# EasyEDA schematic Sheet_1.json
TITLE: 8 Bit ALU - Q XOR M; REV: 1.0; Date: 2021-12-29; Sheet: 1/3; Drawn By: Koehler, Paul; Company: komed3
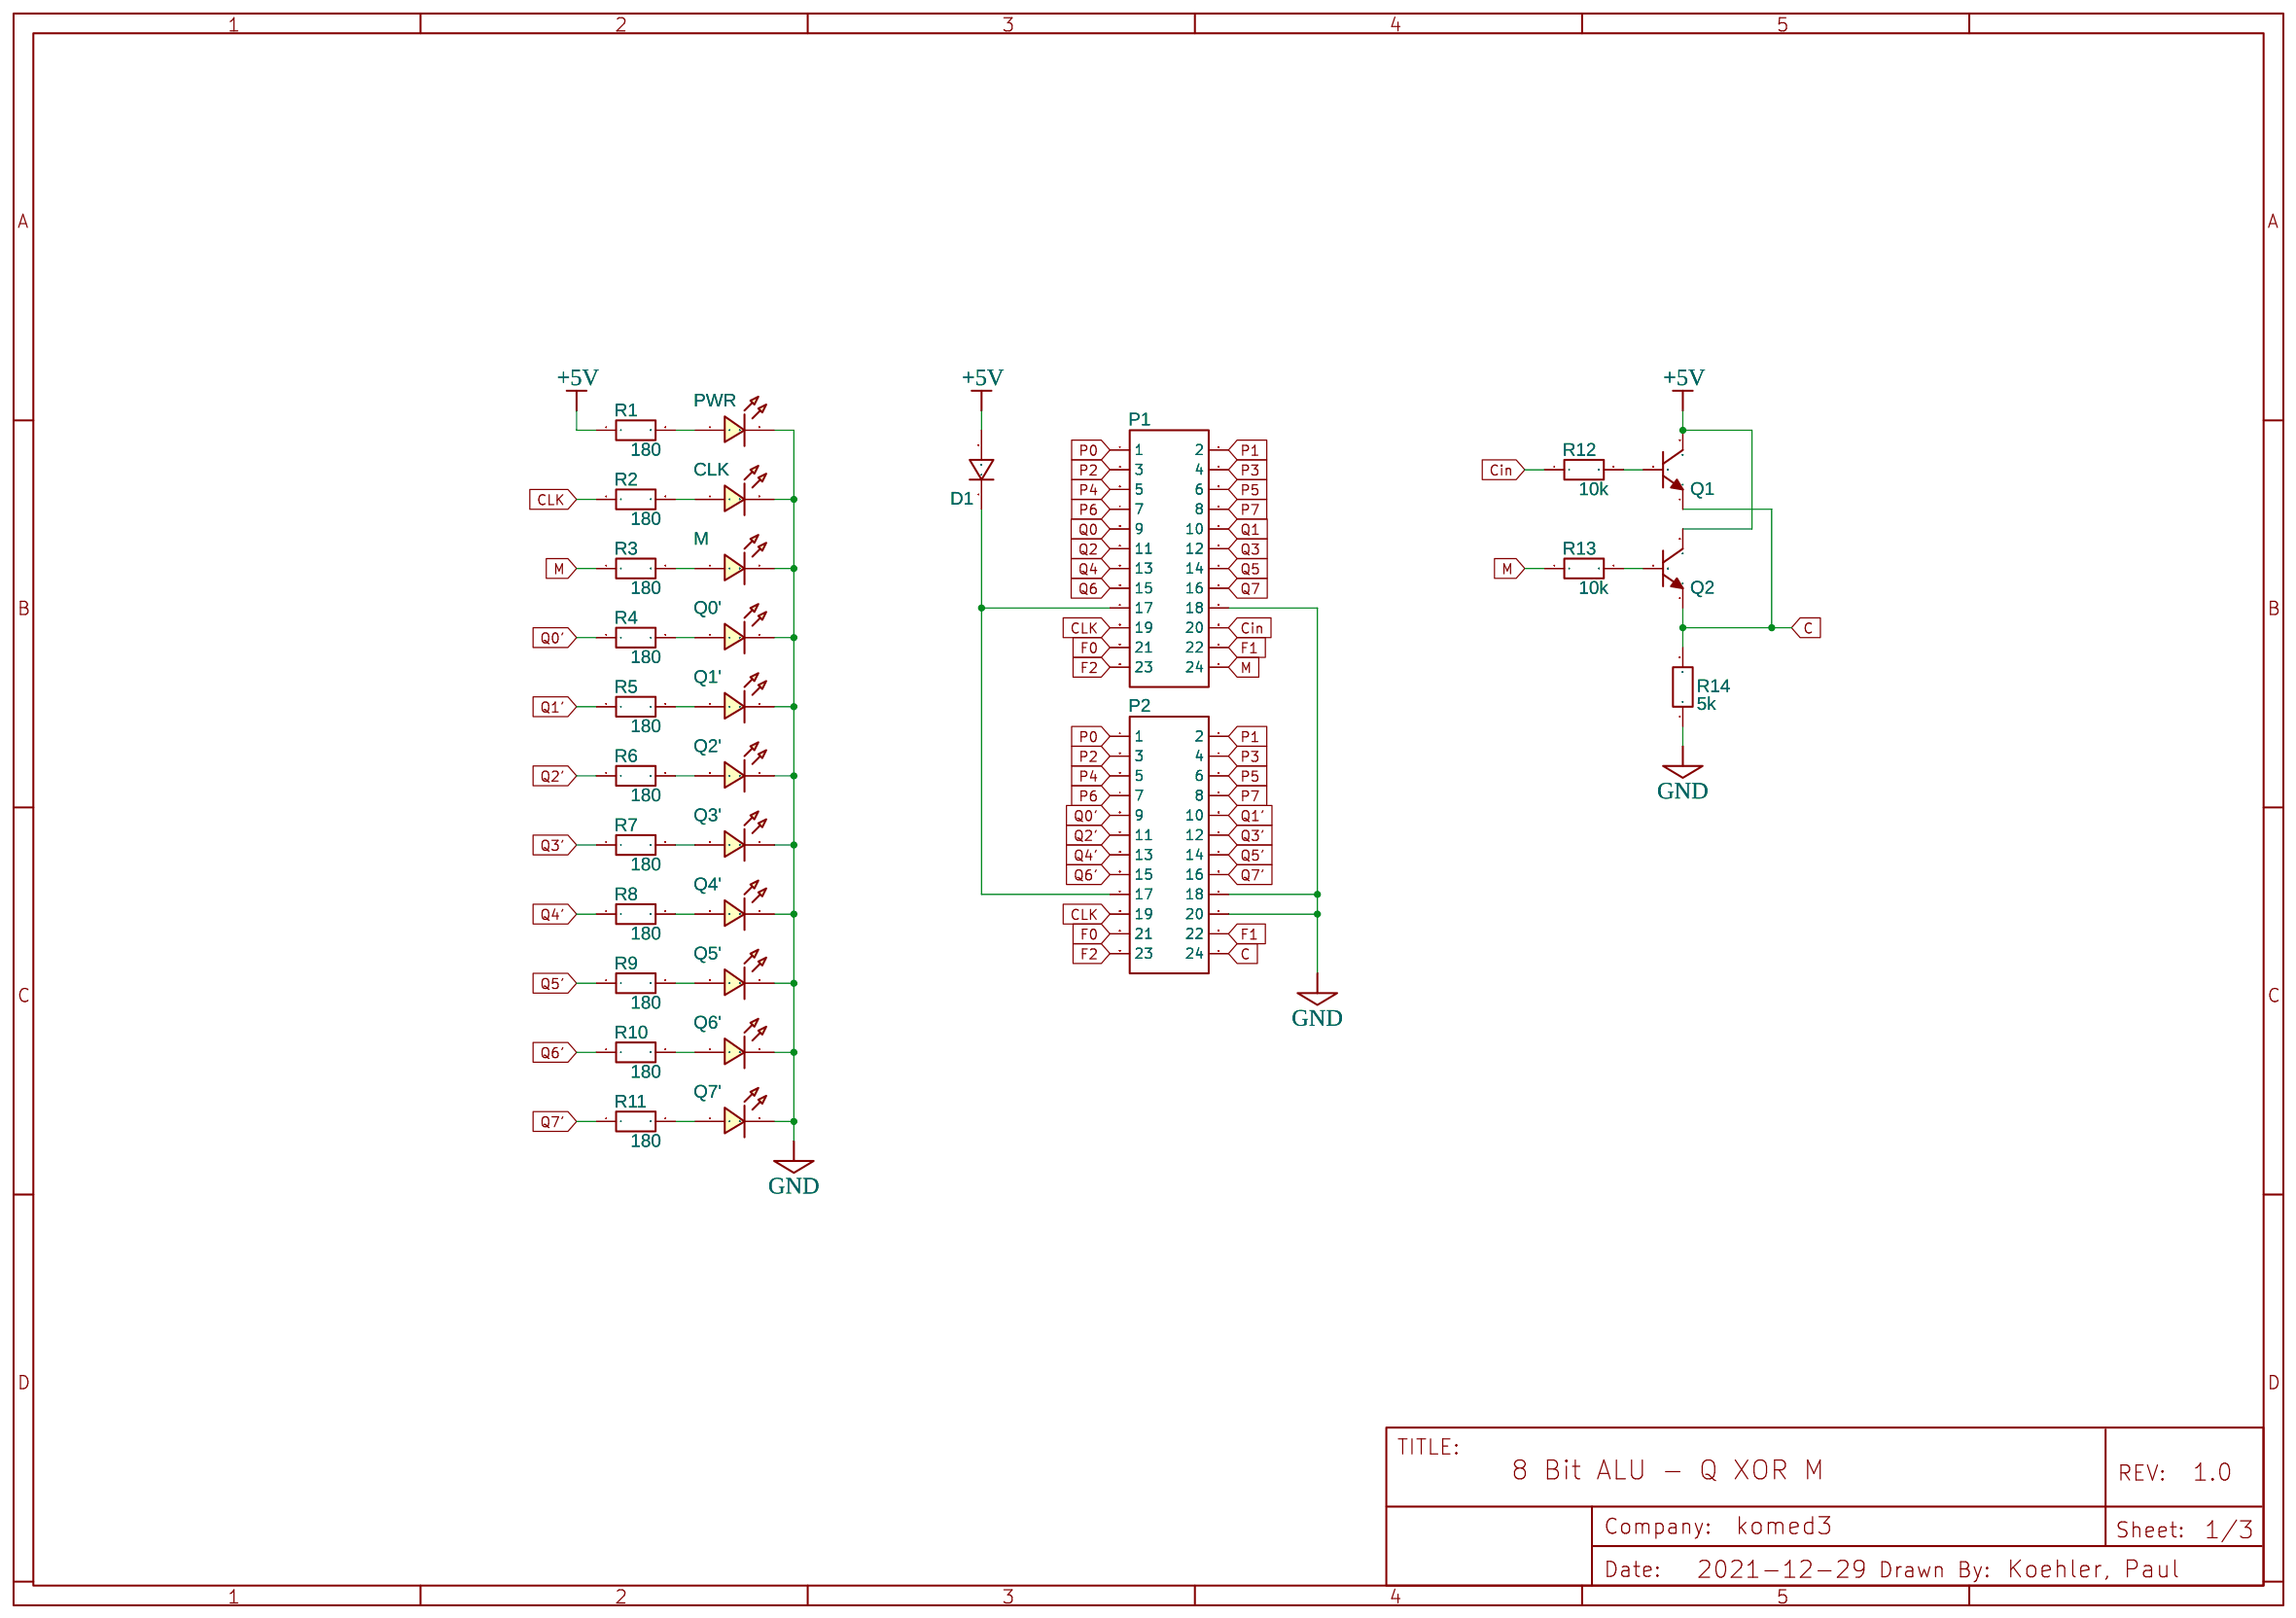
[diagram p0: schematic sheet]

## Parts
CLK  LED-TH-5mm_R  [LED-TH_BD5.0_RED]
D1  1N4007  [DO-41_BD2.4-L4.7-P8.70-D0.9-RD]
M  LED-TH-5mm_R  [LED-TH_BD5.0_RED]
P1  HDR-IDC-2.54-2X12P  [IDC-TH_24P-P2.54-V-R2-C12-S2.54]
P2  HDR-IDC-2.54-2X12P  [IDC-TH_24P-P2.54-V-R2-C12-S2.54]
PWR  LED-TH-5mm_R  [LED-TH_BD5.0_RED]
Q0'  LED-TH-5mm_R  [LED-TH_BD5.0_RED]
Q1  2N3904(TO-92)  [TO-92-3_L5.1-W4.1-P1.27-L]
Q1'  LED-TH-5mm_R  [LED-TH_BD5.0_RED]
Q2  2N3904(TO-92)  [TO-92-3_L5.1-W4.1-P1.27-L]
Q2'  LED-TH-5mm_R  [LED-TH_BD5.0_RED]
Q3'  LED-TH-5mm_R  [LED-TH_BD5.0_RED]
Q4'  LED-TH-5mm_R  [LED-TH_BD5.0_RED]
Q5'  LED-TH-5mm_R  [LED-TH_BD5.0_RED]
Q6'  LED-TH-5mm_R  [LED-TH_BD5.0_RED]
Q7'  LED-TH-5mm_R  [LED-TH_BD5.0_RED]
R1  180  [RESISTOR-1/2W-VERTICAL]
R2  180  [RESISTOR-1/2W-VERTICAL]
R3  180  [RESISTOR-1/2W-VERTICAL]
R4  180  [RESISTOR-1/2W-VERTICAL]
R5  180  [RESISTOR-1/2W-VERTICAL]
R6  180  [RESISTOR-1/2W-VERTICAL]
R7  180  [RESISTOR-1/2W-VERTICAL]
R8  180  [RESISTOR-1/2W-VERTICAL]
R9  180  [RESISTOR-1/2W-VERTICAL]
R10  180  [RESISTOR-1/2W-VERTICAL]
R11  180  [RESISTOR-1/2W-VERTICAL]
R12  10k  [RESISTOR-1/2W-VERTICAL]
R13  10k  [RESISTOR-1/2W-VERTICAL]
R14  5k  [RESISTOR-1/2W-VERTICAL]

## Library data of the parts
CLK M PWR Q0' Q1' Q2' Q3' Q4' Q5' Q6' Q7' = LED-TH-5mm_R: Manufacturer: EVERLIGHT(台湾亿光); Manufacturer Part: 333-2SURD/S530-A3; Supplier Part: C87271; Supplier: LCSC; Contributor: LCEDA_Lib
D1 = 1N4007: Supplier: LCSC; Manufacturer: SEMTECH; Supplier Part: C106903; Contributor: LCEDA_Lib
P1 P2 = HDR-IDC-2.54-2X12P: Supplier: LCSC; Manufacturer: BOOMELE; Manufacturer Part: IDC Box 2X12 2.54MM; image: //image.lceda.cn/szlcsc/C9137.jpg; Supplier Part: C9137
Q1 Q2 = 2N3904(TO-92): Supplier: LCSC; Manufacturer: SEMTECH; Manufacturer Part: 2N3904; Supplier Part: C118538; Contributor: LCEDA_Lib
R1-R14 = R_AXIAL-0.3_EU: Contributor: LCEDA_Lib

## Nets
+5V: D1.2 Q1.3(C) Q2.3(C) R1.1
GND: CLK.2 M.2 P1.18 P2.18 P2.20 PWR.2 Q0'.2 Q1'.2 Q2'.2 Q3'.2 Q4'.2 Q5'.2 Q6'.2 Q7'.2 R14.1
C: P2.24 Q1.1(E) Q2.1(E) R14.2
Cin: P1.20 R12.1
CLK: P1.19 P2.19 R2.1
F0: P1.21 P2.21
F1: P1.22 P2.22
F2: P1.23 P2.23
M: P1.24 R3.1 R13.1
P0: P1.1 P2.1
P1: P1.2 P2.2
P2: P1.3 P2.3
P3: P1.4 P2.4
P4: P1.5 P2.5
P5: P1.6 P2.6
P6: P1.7 P2.7
P7: P1.8 P2.8
Q0: P1.9
Q0': P2.9 R4.1
Q1: P1.10
Q1': P2.10 R5.1
Q2: P1.11
Q2': P2.11 R6.1
Q3: P1.12
Q3': P2.12 R7.1
Q4: P1.13
Q4': P2.13 R8.1
Q5: P1.14
Q5': P2.14 R9.1
Q6: P1.15
Q6': P2.15 R10.1
Q7: P1.16
Q7': P2.16 R11.1
Net-(CLK-1): CLK.1 R2.2
Net-(D1-1): D1.1 P1.17 P2.17
Net-(M-1): M.1 R3.2
Net-(PWR-1): PWR.1 R1.2
Net-(Q0'-1): Q0'.1 R4.2
Net-(Q1'-1): Q1'.1 R5.2
Net-(Q1-2): Q1.2(B) R12.2
Net-(Q2'-1): Q2'.1 R6.2
Net-(Q2-2): Q2.2(B) R13.2
Net-(Q3'-1): Q3'.1 R7.2
Net-(Q4'-1): Q4'.1 R8.2
Net-(Q5'-1): Q5'.1 R9.2
Net-(Q6'-1): Q6'.1 R10.2
Net-(Q7'-1): Q7'.1 R11.2
